# EAGLE design ElectricalDiagram (EAGLE 9.6.1)
CNAME: Flora Electrical System
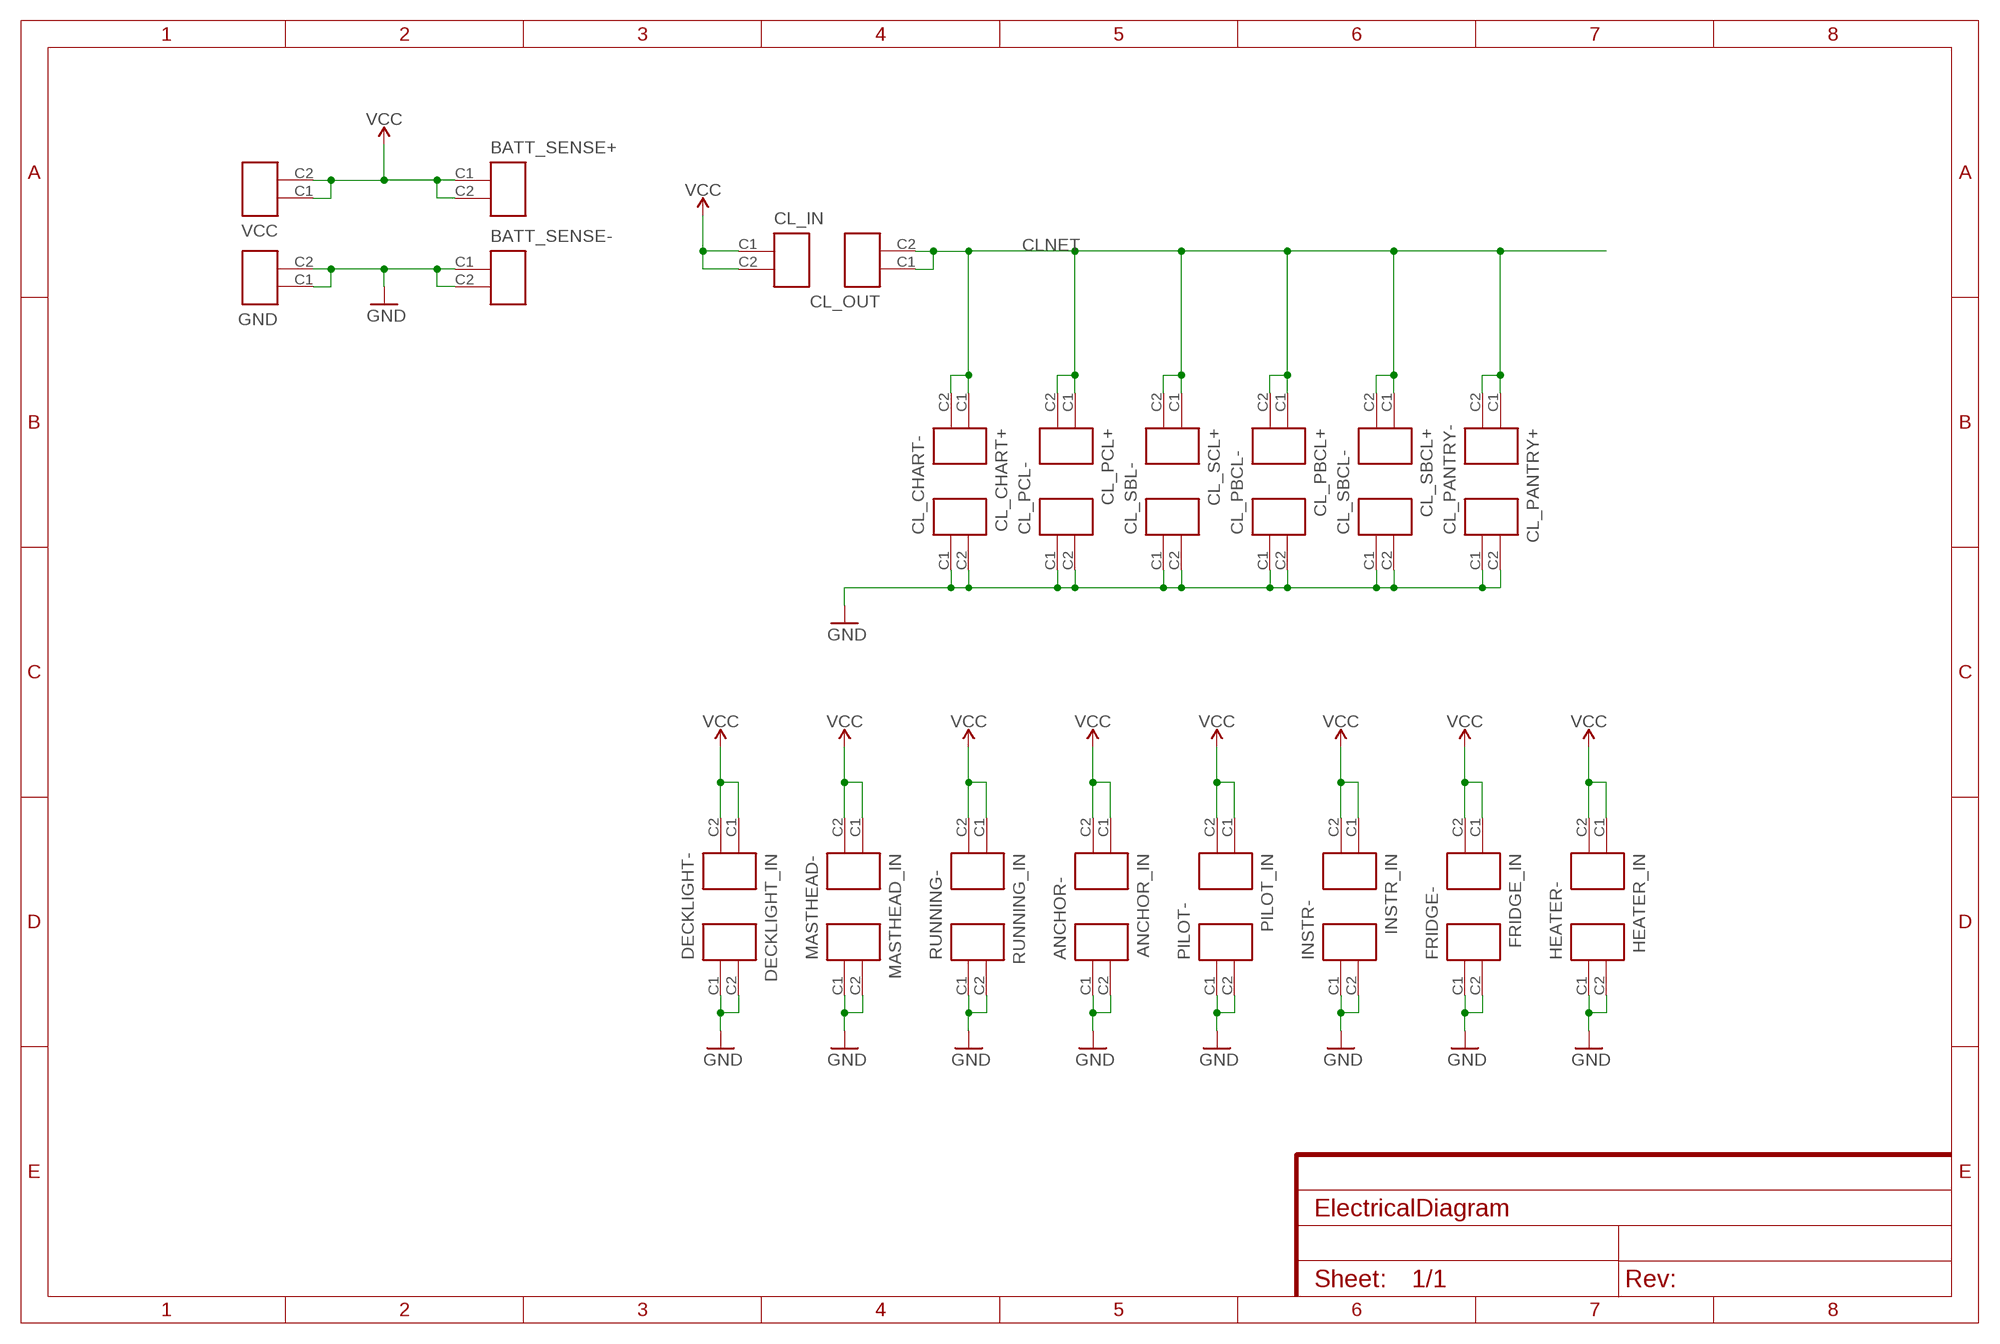
[diagram p0: schematic, sheet 1]

## Parts
ANCHOR-  1201-01-001-SPADE  [1201-01-001-SPADE]
ANCHOR_IN  1201-01-001-SPADE  [1201-01-001-SPADE]
BATT_SENSE+  1201-01-001-SPADE  [1201-01-001-SPADE]
BATT_SENSE-  1201-01-001-SPADE  [1201-01-001-SPADE]
CL_CHART+  1201-01-001-SPADE  [1201-01-001-SPADE]
CL_CHART-  1201-01-001-SPADE  [1201-01-001-SPADE]
CL_IN  1201-01-001-SPADE  [1201-01-001-SPADE]
CL_OUT  1201-01-001-SPADE  [1201-01-001-SPADE]
CL_PANTRY+  1201-01-001-SPADE  [1201-01-001-SPADE]
CL_PANTRY-  1201-01-001-SPADE  [1201-01-001-SPADE]
CL_PBCL+  1201-01-001-SPADE  [1201-01-001-SPADE]
CL_PBCL-  1201-01-001-SPADE  [1201-01-001-SPADE]
CL_PCL+  1201-01-001-SPADE  [1201-01-001-SPADE]
CL_PCL-  1201-01-001-SPADE  [1201-01-001-SPADE]
CL_SBCL+  1201-01-001-SPADE  [1201-01-001-SPADE]
CL_SBCL-  1201-01-001-SPADE  [1201-01-001-SPADE]
CL_SBL-  1201-01-001-SPADE  [1201-01-001-SPADE]
CL_SCL+  1201-01-001-SPADE  [1201-01-001-SPADE]
DECKLIGHT-  1201-01-001-SPADE  [1201-01-001-SPADE]
DECKLIGHT_IN  1201-01-001-SPADE  [1201-01-001-SPADE]
FRIDGE-  1201-01-001-SPADE  [1201-01-001-SPADE]
FRIDGE_IN  1201-01-001-SPADE  [1201-01-001-SPADE]
GND  1201-01-001-SPADE  [1201-01-001-SPADE]
HEATER-  1201-01-001-SPADE  [1201-01-001-SPADE]
HEATER_IN  1201-01-001-SPADE  [1201-01-001-SPADE]
INSTR-  1201-01-001-SPADE  [1201-01-001-SPADE]
INSTR_IN  1201-01-001-SPADE  [1201-01-001-SPADE]
MASTHEAD-  1201-01-001-SPADE  [1201-01-001-SPADE]
MASTHEAD_IN  1201-01-001-SPADE  [1201-01-001-SPADE]
PILOT-  1201-01-001-SPADE  [1201-01-001-SPADE]
PILOT_IN  1201-01-001-SPADE  [1201-01-001-SPADE]
RUNNING-  1201-01-001-SPADE  [1201-01-001-SPADE]
RUNNING_IN  1201-01-001-SPADE  [1201-01-001-SPADE]
VCC  1201-01-001-SPADE  [1201-01-001-SPADE]

## Nets
CLNET: CL_CHART+.C1 CL_CHART+.C2 CL_OUT.C1 CL_OUT.C2 CL_PANTRY+.C1 CL_PANTRY+.C2 CL_PBCL+.C1 CL_PBCL+.C2 CL_PCL+.C1 CL_PCL+.C2 CL_SBCL+.C1 CL_SBCL+.C2 CL_SCL+.C1 CL_SCL+.C2
GND: ANCHOR-.C1 ANCHOR-.C2 BATT_SENSE-.C1 BATT_SENSE-.C2 CL_CHART-.C1 CL_CHART-.C2 CL_PANTRY-.C1 CL_PANTRY-.C2 CL_PBCL-.C1 CL_PBCL-.C2 CL_PCL-.C1 CL_PCL-.C2 CL_SBCL-.C1 CL_SBCL-.C2 CL_SBL-.C1 CL_SBL-.C2 DECKLIGHT-.C1 DECKLIGHT-.C2 FRIDGE-.C1 FRIDGE-.C2 GND.C1 GND.C2 HEATER-.C1 HEATER-.C2 INSTR-.C1 INSTR-.C2 MASTHEAD-.C1 MASTHEAD-.C2 PILOT-.C1 PILOT-.C2 RUNNING-.C1 RUNNING-.C2
VCC: ANCHOR_IN.C1 ANCHOR_IN.C2 BATT_SENSE+.C1 BATT_SENSE+.C2 CL_IN.C1 CL_IN.C2 DECKLIGHT_IN.C1 DECKLIGHT_IN.C2 FRIDGE_IN.C1 FRIDGE_IN.C2 HEATER_IN.C1 HEATER_IN.C2 INSTR_IN.C1 INSTR_IN.C2 MASTHEAD_IN.C1 MASTHEAD_IN.C2 PILOT_IN.C1 PILOT_IN.C2 RUNNING_IN.C1 RUNNING_IN.C2 VCC.C1 VCC.C2

## Library data of the parts
ANCHOR- ANCHOR_IN BATT_SENSE+ BATT_SENSE- CL_CHART+ CL_CHART- CL_IN CL_OUT CL_PANTRY+ CL_PANTRY- CL_PBCL+ CL_PBCL- CL_PCL+ CL_PCL- CL_SBCL+ CL_SBCL- CL_SBL- CL_SCL+ DECKLIGHT- DECKLIGHT_IN FRIDGE- FRIDGE_IN GND HEATER- HEATER_IN INSTR- INSTR_IN MASTHEAD- MASTHEAD_IN PILOT- PILOT_IN RUNNING- RUNNING_IN VCC = 12_Connectors:1201-01-001-SPADE

## Board
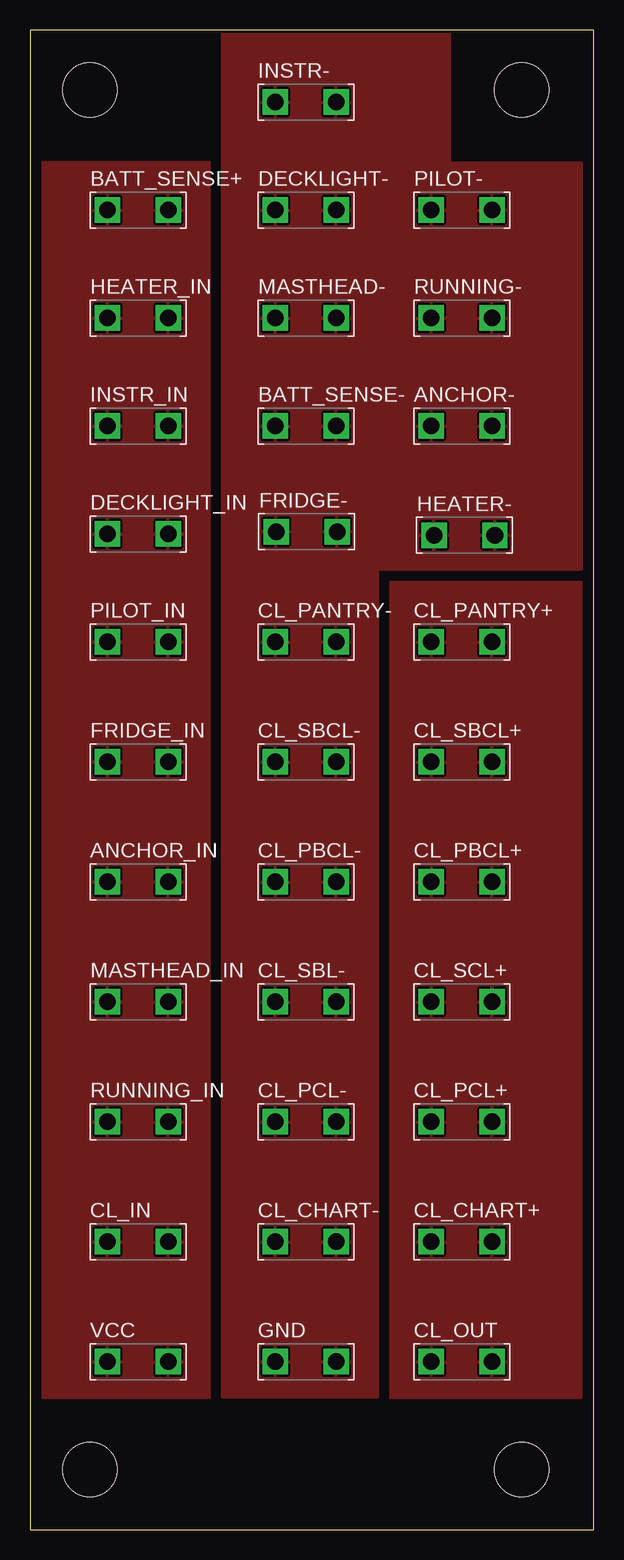
[diagram p1: board, top side]
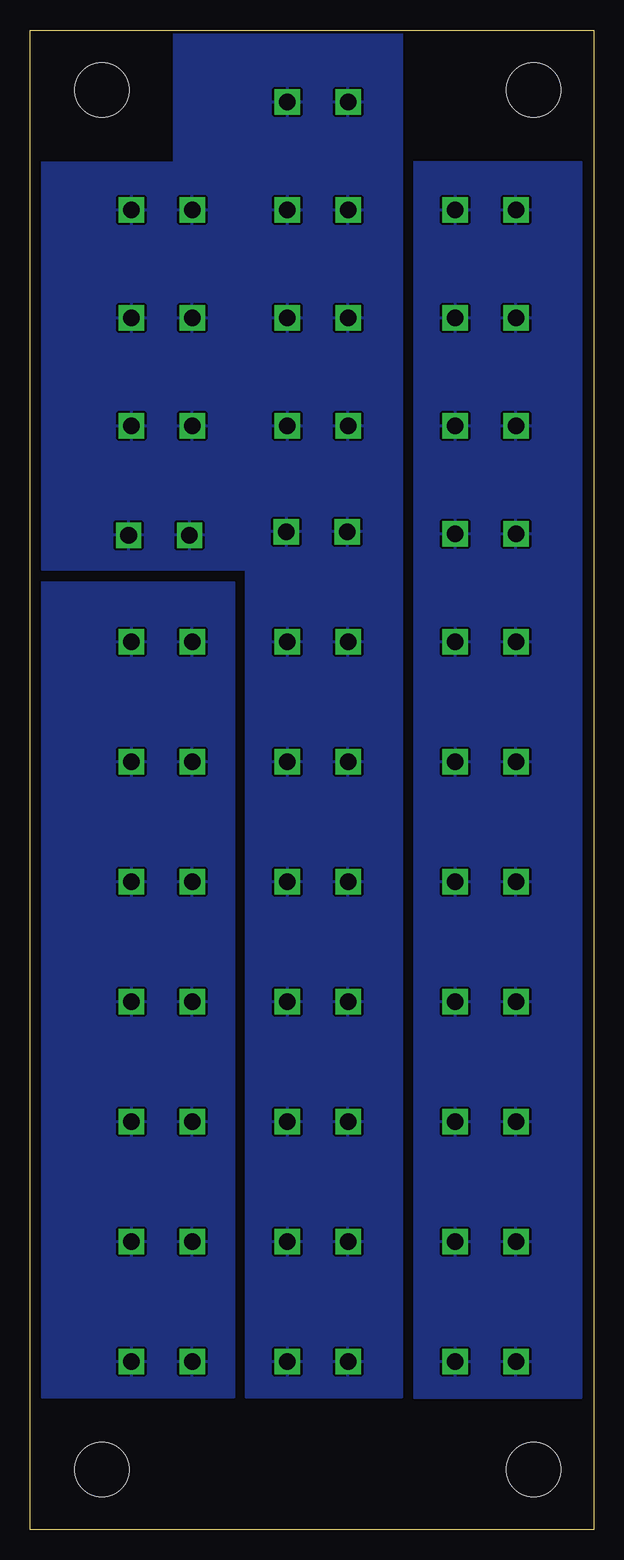
[diagram p2: board, bottom side, seen from below]

Size 47 x 125 mm. Coordinates in mm from the lower left corner, seen from the top.
Outline: 0,0 47,0 47,125 0,125 0,0
Copper layers (1*16): Top 0.018mm / dielectric 1.55mm / Bottom 0.018mm
Design rules "eC_2Layer_PClass6_BaseCopperO18_eCDefault": minimum track width 0.15mm, minimum drill 0.35mm, track to track 0.15mm, track to pad 0.15mm, pad to pad 0.15mm, via to via 0.15mm, smd to smd 0mil, copper to edge 0.25mm, drill to drill 0.35mm, minimum pad ring 0.175mm, minimum via ring 0.125mm, stop-mask expansion 0mil, vias tented up to drill 0.45mm, thermal gap 0.2mm
Holes 4.5 mm at 5,120 5,5 41,5 41,120

### Footprints (pad centres in the part's own frame; a part is rotated, then mirrored left to right if it is on the bottom)
1201-01-001-SPADE = drill 1.4 square: C1 -2.54,0; C2 2.54,0

### Placement (x,y rotation side)
ANCHOR-  36,92 0 top
ANCHOR_IN  9,54 0 top
BATT_SENSE+  9,110 0 top
BATT_SENSE-  23,92 0 top
CL_CHART+  36,24 0 top
CL_CHART-  23,24 0 top
CL_IN  9,24 0 top
CL_OUT  36,14 0 top
CL_PANTRY+  36,74 0 top
CL_PANTRY-  23,74 0 top
CL_PBCL+  36,54 0 top
CL_PBCL-  23,54 0 top
CL_PCL+  36,34 0 top
CL_PCL-  23,34 0 top
CL_SBCL+  36,64 0 top
CL_SBCL-  23,64 0 top
CL_SBL-  23,44 0 top
CL_SCL+  36,44 0 top
DECKLIGHT-  23,110 0 top
DECKLIGHT_IN  9,83 0 top
FRIDGE-  23.08,83.17 0 top
FRIDGE_IN  9,64 0 top
GND  23,14 0 top
HEATER-  36.24,82.88 0 top
HEATER_IN  9,101 0 top
INSTR-  23,119 0 top
INSTR_IN  9,92 0 top
MASTHEAD-  23,101 0 top
MASTHEAD_IN  9,44 0 top
PILOT-  36,110 0 top
PILOT_IN  9,74 0 top
RUNNING-  36,101 0 top
RUNNING_IN  9,34 0 top
VCC  9,14 0 top

### Tracks (layer width: path | path; a pad name or v marks a point on that pad's centre or on a via)
CLNET
  pour Bottom: 30,11 46,11 46,79 30,79
  pour Top: 30,11 46,11 46,79 30,79
GND
  pour Top: 16,125 35,125 35,114 46,114 46,80 29,80 29,11 16,11
  pour Bottom: 16,11 29,11 29,80 46,80 46,114 35,114 35,125 16,125
VCC
  pour Top: 1,11 15,11 15,114 1,114
  pour Bottom: 1,114 15,114 15,11 1,11